# EAGLE schematic Spark (EAGLE 6.5.0)
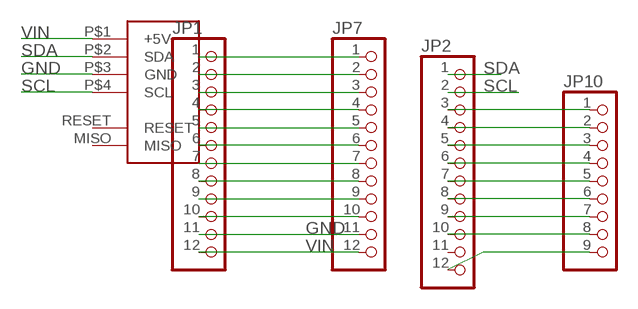
[diagram p0: schematic, sheet 1]

## Parts
JP1  PINHD-1X12-CB  [1X12-CB]
JP2  PINHD-1X12-CB  [1X12-CB]
JP7  PINHD-1X12-CB  [1X12-CB]
JP10  PINHD-1X9  [1X09-BIG]
U$1  FOOTPRINTDOUBLE  [FOOTPRINT-DOUBLE]

## Nets
GND: JP1.2 JP7.2 U$1.P$3(GND)
N$5: JP2.3 JP10.1
N$6: JP2.4 JP10.2
N$7: JP2.5 JP10.3
N$8: JP2.6 JP10.4
N$9: JP2.7 JP10.5
N$10: JP2.8 JP10.6
N$11: JP2.9 JP10.7
N$12: JP2.10 JP10.8
N$13: JP2.12 JP10.9
N$14: JP1.3 JP7.3
N$15: JP1.4 JP7.4
N$16: JP1.5 JP7.5
N$17: JP1.6 JP7.6
N$18: JP1.7 JP7.7
N$19: JP1.8 JP7.8
N$20: JP1.9 JP7.9
N$21: JP1.10 JP7.10
N$22: JP1.11 JP7.11
N$23: JP1.12 JP7.12
SCL: JP2.2 U$1.P$4(SCL)
SDA: JP2.1 U$1.P$2(SDA)
VIN: JP1.1 JP7.1 U$1.P$1(+5V)
Unconnected: JP2.11 U$1.MISO U$1.RESET

## Library data of the parts
JP1 JP2 JP7 = adafruit:PINHD-1X12: PIN HEADER
JP10 = adafruit:PINHD-1X9: Pin header 1x10 0.1" spacing With round pins
U$1 = IntegerLabs:FOOTPRINT